# EAGLE design Xbee_shield (EAGLE 6.4)
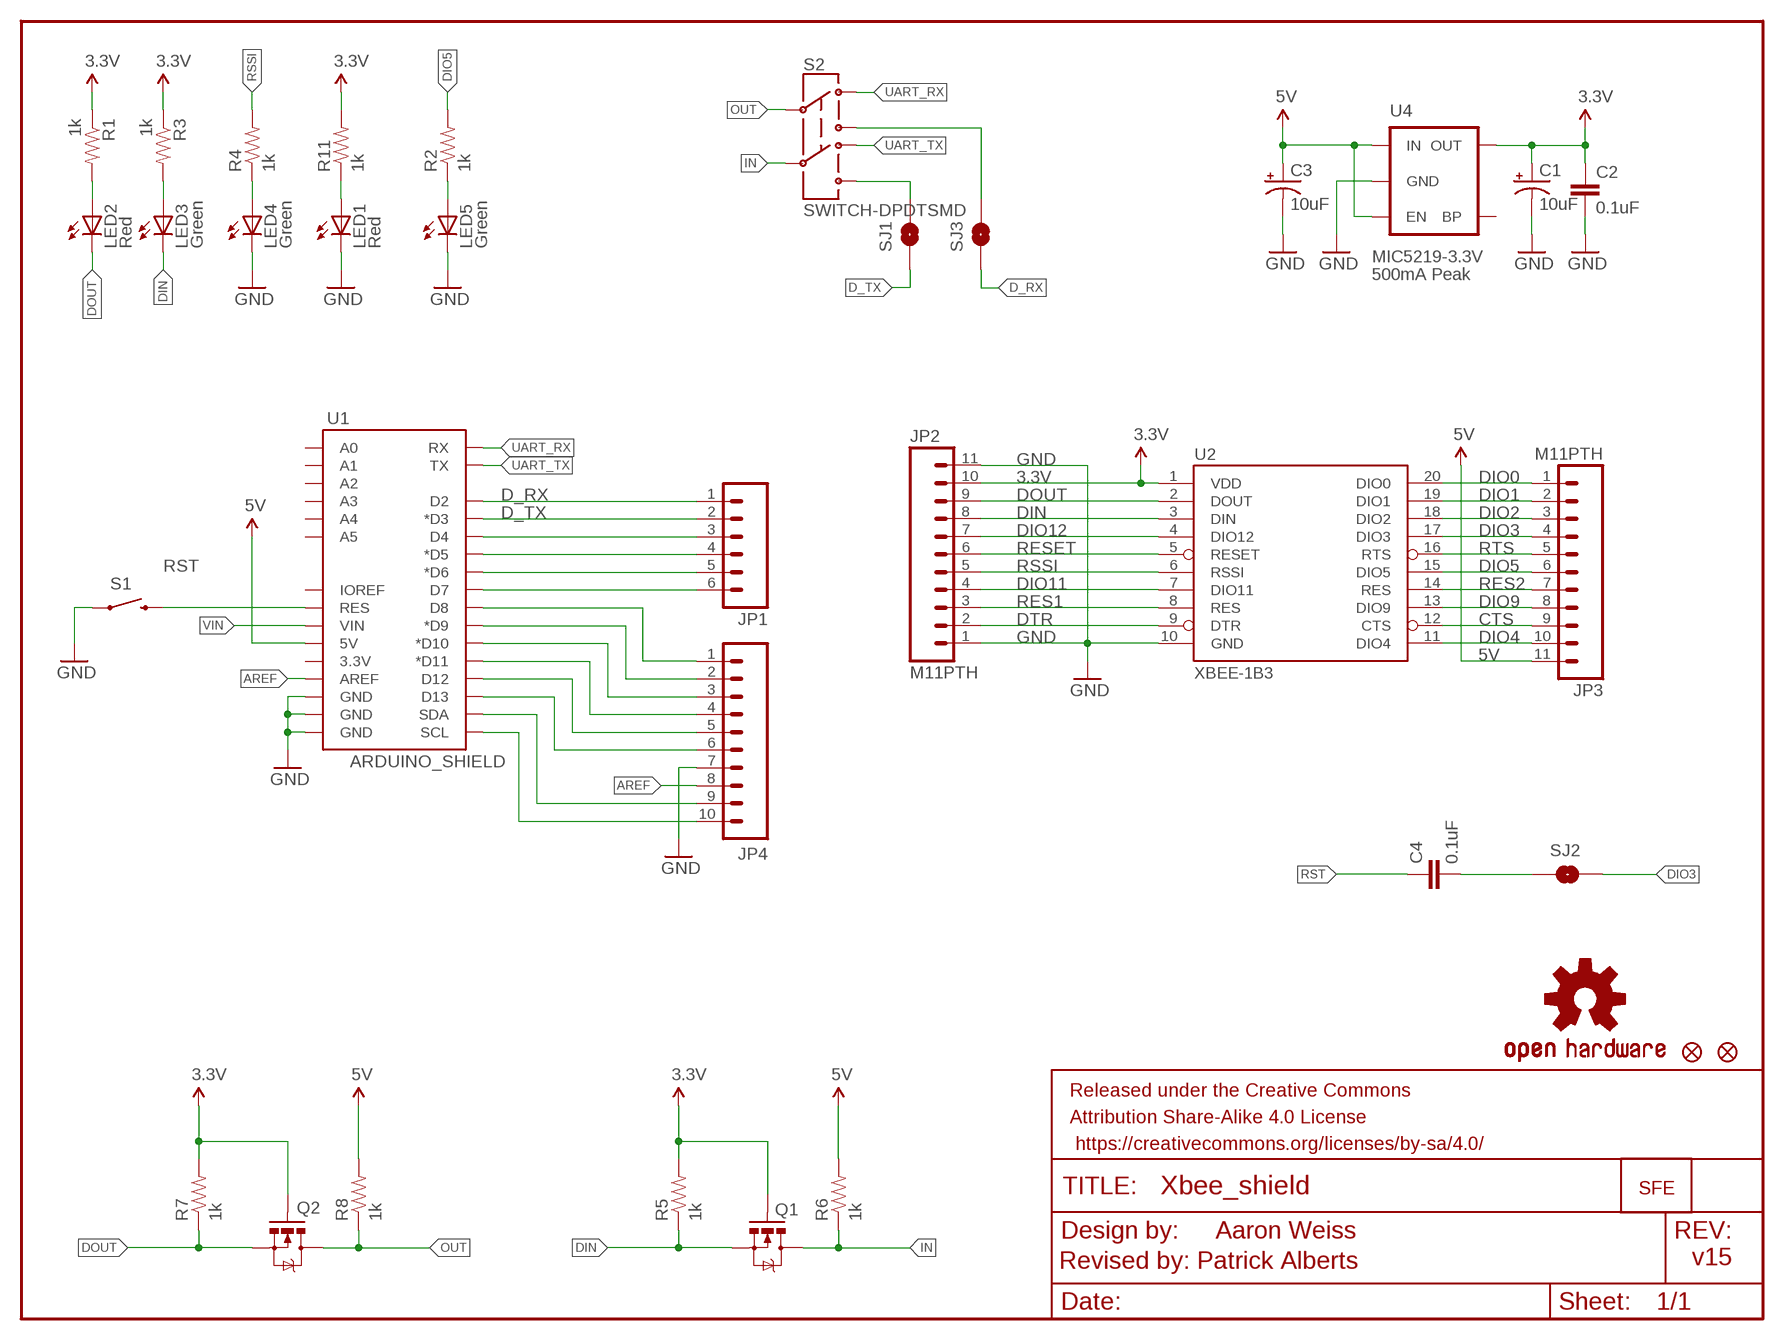
[diagram p0: schematic, sheet 1]

## Parts
C1  10uF  CAP_POL1206  [EIA3216]
C2  0.1uF  0.1UF-25V(+80/-20%)(0603)  [0603-CAP]
C3  10uF  CAP_POL1206  [EIA3216]
C4  0.1uF  0.1UF-25V(+80/-20%)(0603)  [0603-CAP]
FRAME1  FRAME-LETTER  [CREATIVE_COMMONS]
JP1  M06SIP  [1X06]
JP2  M11PTH  [1X11]
JP3  M11PTH  [1X11]
JP4  M10"  [1X10]
JP5  FIDUCIAL1X2  [FIDUCIAL-1X2]
JP6  FIDUCIAL1X2  [FIDUCIAL-1X2]
JP7  LOGO-SFENEW  [SFE-NEW-WEBLOGO]
LED1  Red  LED-RED0603  [LED-0603]
LED2  Red  LED-RED0603  [LED-0603]
LED3  Green  LED-GREEN0603  [LED-0603]
LED4  Green  LED-GREEN0603  [LED-0603]
LED5  Green  LED-GREEN0603  [LED-0603]
Q1  MOSFET-NCHANNELSMD  [SOT23-3]
Q2  MOSFET-NCHANNELSMD  [SOT23-3]
R1  1k  1KOHM1/10W1%(0603)  [0603-RES]
R2  1k  1KOHM1/10W1%(0603)  [0603-RES]
R3  1k  1KOHM1/10W1%(0603)  [0603-RES]
R4  1k  1KOHM1/10W1%(0603)  [0603-RES]
R5  1k  1KOHM1/10W1%(0603)  [0603-RES]
R6  1k  1KOHM1/10W1%(0603)  [0603-RES]
R7  1k  1KOHM1/10W1%(0603)  [0603-RES]
R8  1k  1KOHM1/10W1%(0603)  [0603-RES]
R11  1k  1KOHM1/10W1%(0603)  [0603-RES]
S1  SWITCH-MOMENTARY-2SMD  [TACTILE_SWITCH_SMD]
S2  SWITCH-DPDTSMD  [AYZ0202]
SJ1  D_TX  SOLDERJUMPERNC  [SJ_2S]
SJ2  SOLDERJUMPERTRACE  [SJ_2S-TRACE]
SJ3  D_RX  SOLDERJUMPERNC  [SJ_2S]
U1  ARDUINO_SHIELD  ARDUINO_R3_SHIELD  [UNO_R3_SHIELD]
U2  XBEE-1B3  [XBEE-SMD]
U4  V_REG_LDOSMD  [SOT23-5]
U$8  OSHW-LOGOS  [OSHW-LOGO-S]

## Nets
3.3V: C1.A(+) C2.1 JP2.10 Q1.1(G) Q2.1(G) R1.1 R3.1 R5.2 R7.2 R11.2 U2.1(VDD) U4.5(OUT)
5V: C3.A(+) JP3.11 R6.2 R8.2 U1.5V U4.1(IN) U4.3(EN)
AREF: JP4.8 U1.AREF
CTS: JP3.9 U2.12(CTS)
D_RX: JP1.1 SJ3.1 U1.D2
D_TX: JP1.2 SJ1.1 U1.D3(*D3)
DIN: JP2.8 LED3.C Q1.2(S) R5.1 U2.3(DIN)
DIO0: JP3.1 U2.20(DIO0)
DIO1: JP3.2 U2.19(DIO1)
DIO2: JP3.3 U2.18(DIO2)
DIO3: JP3.4 SJ2.2 U2.17(DIO3)
DIO4: JP3.10 U2.11(DIO4)
DIO5: JP3.6 R2.2 U2.15(DIO5)
DIO9: JP3.8 U2.13(DIO9)
DIO11: JP2.4 U2.7(DIO11)
DIO12: JP2.7 U2.4(DIO12)
DOUT: JP2.9 LED2.C Q2.2(S) R7.1 U2.2(DOUT)
DTR: JP2.2 U2.9(DTR)
GND: C1.C(-) C2.2 C3.C(-) JP2.1 JP2.11 JP4.7 LED1.C LED4.C LED5.C S1.1 U1.GND@0(GND) U1.GND@1(GND) U1.GND@2(GND) U2.10(GND) U4.2(GND)
IN: Q1.3(D) R6.1 S2.5
N$1: LED2.A R1.2
N$2: LED4.A R4.1
N$3: JP4.6 U1.D13
N$4: LED3.A R3.2
N$5: C4.2 SJ2.1
N$6: JP4.9 U1.SDA
N$7: JP4.10 U1.SCL
N$17: JP4.1 U1.D8
N$18: JP4.2 U1.D9(*D9)
N$30: JP4.3 U1.D10(*D10)
N$38: LED1.A R11.1
N$43: JP4.4 U1.D11(*D11)
N$55: JP4.5 U1.D12
N$139: LED5.A R2.1
N$140: S2.6 SJ1.2
N$141: S2.3 SJ3.2
N$142: JP1.3 U1.D4
N$143: JP1.4 U1.D5(*D5)
N$144: JP1.5 U1.D6(*D6)
N$145: JP1.6 U1.D7
OUT: Q2.3(D) R8.1 S2.2
RES1: JP2.3 U2.8(RES)
RES2: JP3.7 U2.14(RES)
RESET: JP2.6 U2.5(RESET)
RSSI: JP2.5 R4.2 U2.6(RSSI)
RST: C4.1 S1.3 U1.RES
RTS: JP3.5 U2.16(RTS)
UART_RX: S2.1 U1.RX
UART_TX: S2.4 U1.TX
VIN: U1.VIN
Unconnected: U1.3.3V U1.A0 U1.A1 U1.A2 U1.A3 U1.A4 U1.A5 U1.IOREF U4.4(BP)

## Notes on the sheet
- MIC5219-3.3V
- 500mA Peak
- Aaron Weiss
- Revised by: Patrick Alberts | v15

## Library data of the parts
C1 C3 = SparkFun:CAP_POL: Capacitor Polarized These are standard SMD and PTH capacitors. Normally 10uF, 47uF, and 100uF in electrolytic and tantalum varieties. Always verify the external diameter of the through hole cap, it varies with capacity, voltage, and manufacturer. The EIA devices should be standard.
C2 C4 = SparkFun-Capacitors:0.1UF-25V(+80/-20%)(0603): CAP-00810 Ceramic Standard decoupling cap; PROD_ID: CAP-00810
FRAME1 = SparkFun-Aesthetics:FRAME-LETTER: Schematic Frame Standard 8.5x11 US Letter frame
JP1 = SparkFun:M06: Header 6 Standard 6-pin 0.1" header. Use with straight break away headers (SKU : PRT-00116), right angle break away headers (PRT-00553), swiss pins (PRT-00743), machine pins (PRT-00117), and female headers (PRT-00115). Molex polarized connector foot print use with SKU : PRT-08094 with associated crimp pins and housings. NOTES ON THE VARIANTS LOCK and LOCK_LONGPADS... This footprint was designed to help hold the alignment of a through-hole component (i.e. 6-pin header) while soldering it into place. You may notice that each hole has been shifted either up or down by 0.005 of an inch from it's more standard position (which is a perfectly straight line). This slight alteration caused the pins (the squares in the middle) to touch the edges of the holes. Because they are alternating, it causes a "brace" to hold the component in place. 0.005 has proven to be the perfect amount of "off-center" position when using our standard breakaway headers. Although looks a little odd when you look at the bare footprint, once you have a header in there, the alteration is very hard to notice. Also, if you push a header all the way into place, it is covered up entirely on the bottom side. This idea of altering the position of holes to aid alignment will be further integrated into the Sparkfun Library for other footprints. It can help hold any component with 3 or more connection pins.
JP2 JP3 = SparkFun:M11: Header 11 Standard 11-pin 0.1" header. Use with straight break away headers (SKU : PRT-00116), right angle break away headers (PRT-00553), swiss pins (PRT-00743), machine pins (PRT-00117), and female headers (PRT-00115).
JP4 = SparkFun-Connectors:M10: Header 10 Standard 10-pin 0.1" header. Use with straight break away headers (SKU : PRT-00116), right angle break away headers (PRT-00553), swiss pins (PRT-00743), machine pins (PRT-00117), and female headers (PRT-00115).
JP5 JP6 = SparkFun:FIDUCIAL: Fiducial Alignment Points Various fiducial points for machine vision alignment.
JP7 = SparkFun-Aesthetics:LOGO-SFE: Spark Fun Electronics PCB Logo This is the standard Spark Fun Electronics PCB logo.
LED1 LED2 = SparkFun-LED:LED-RED: Assorted Red LEDs LilyPad 1206- DIO-09912 1206- DIO-00809 0603- DIO-00819; PROD_ID: DIO-00819; VALUE: RED
LED3-LED5 = SparkFun-LED:LED-GREEN: Various green LEDs Green LEDs used in SFE Production 0603- DIO-00821 LARGE- DIO-00862 LILYPAD- DIO-09910; PROD_ID: DIO-00821; VALUE: GREEN
Q1 Q2 = SparkFun-DiscreteSemi:MOSFET-NCHANNEL: Generic NMOS footprint
R1-R8 R11 = SparkFun-Resistors:1KOHM1/10W1%(0603): RES-07856; PROD_ID: RES-07856; VALUE: 1K
S1 = SparkFun:SWITCH-MOMENTARY-2
S2 = SparkFun:SWITCH-DPDT: DPDT Version of the COM-00597
SJ1-SJ3 = SparkFun:SOLDERJUMPER: Solder Jumper Standard SMD solder jumper. Used to automate production. Two varients : Normally Open and Normally Closed are the same, but have different paste layers. NC will have a large amount of paste and should jumper during reflow.
U1 = SparkFun-Boards:ARDUINO_R3_SHIELD: Shield form compatible with the Arduino Uno R3.
U2 = SparkFun:XBEE-1
U4 = SparkFun-PowerIC:V_REG_LDO: Voltage Regulator LDO Standard 150mA LDO voltage regulator in SOT-23 layout. Micrel part MIC5205. BP (by-pass) pin is used to lower output noise with 470pF cap.
U$8 = SparkFun-Aesthetics:OSHW-LOGO: Open Source Hardware Logo This logo indicates the piece of hardware it is found on incorporates a OSHW license and/or adheres to the definition of open source hardware found here: http://freedomdefined.org/OSHW

## Net classes
0 default: width 0.203 mm
1 vcc: width 0.305 mm

## Board
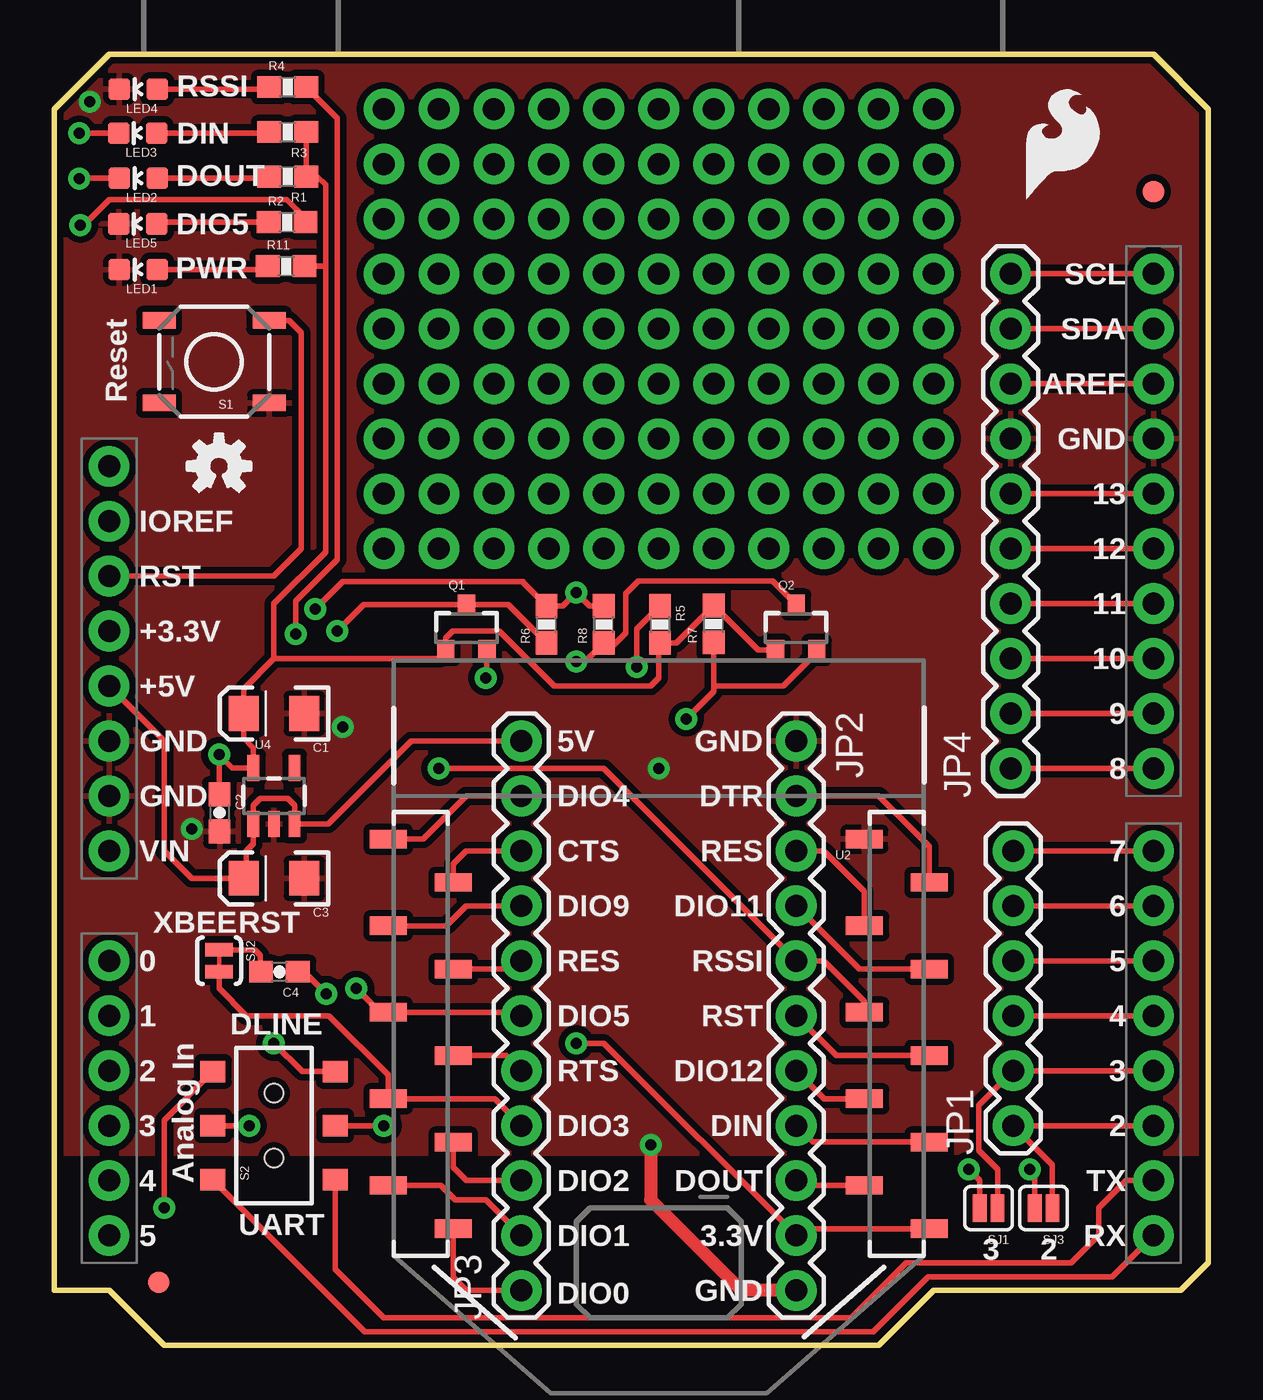
[diagram p1: board, top side]
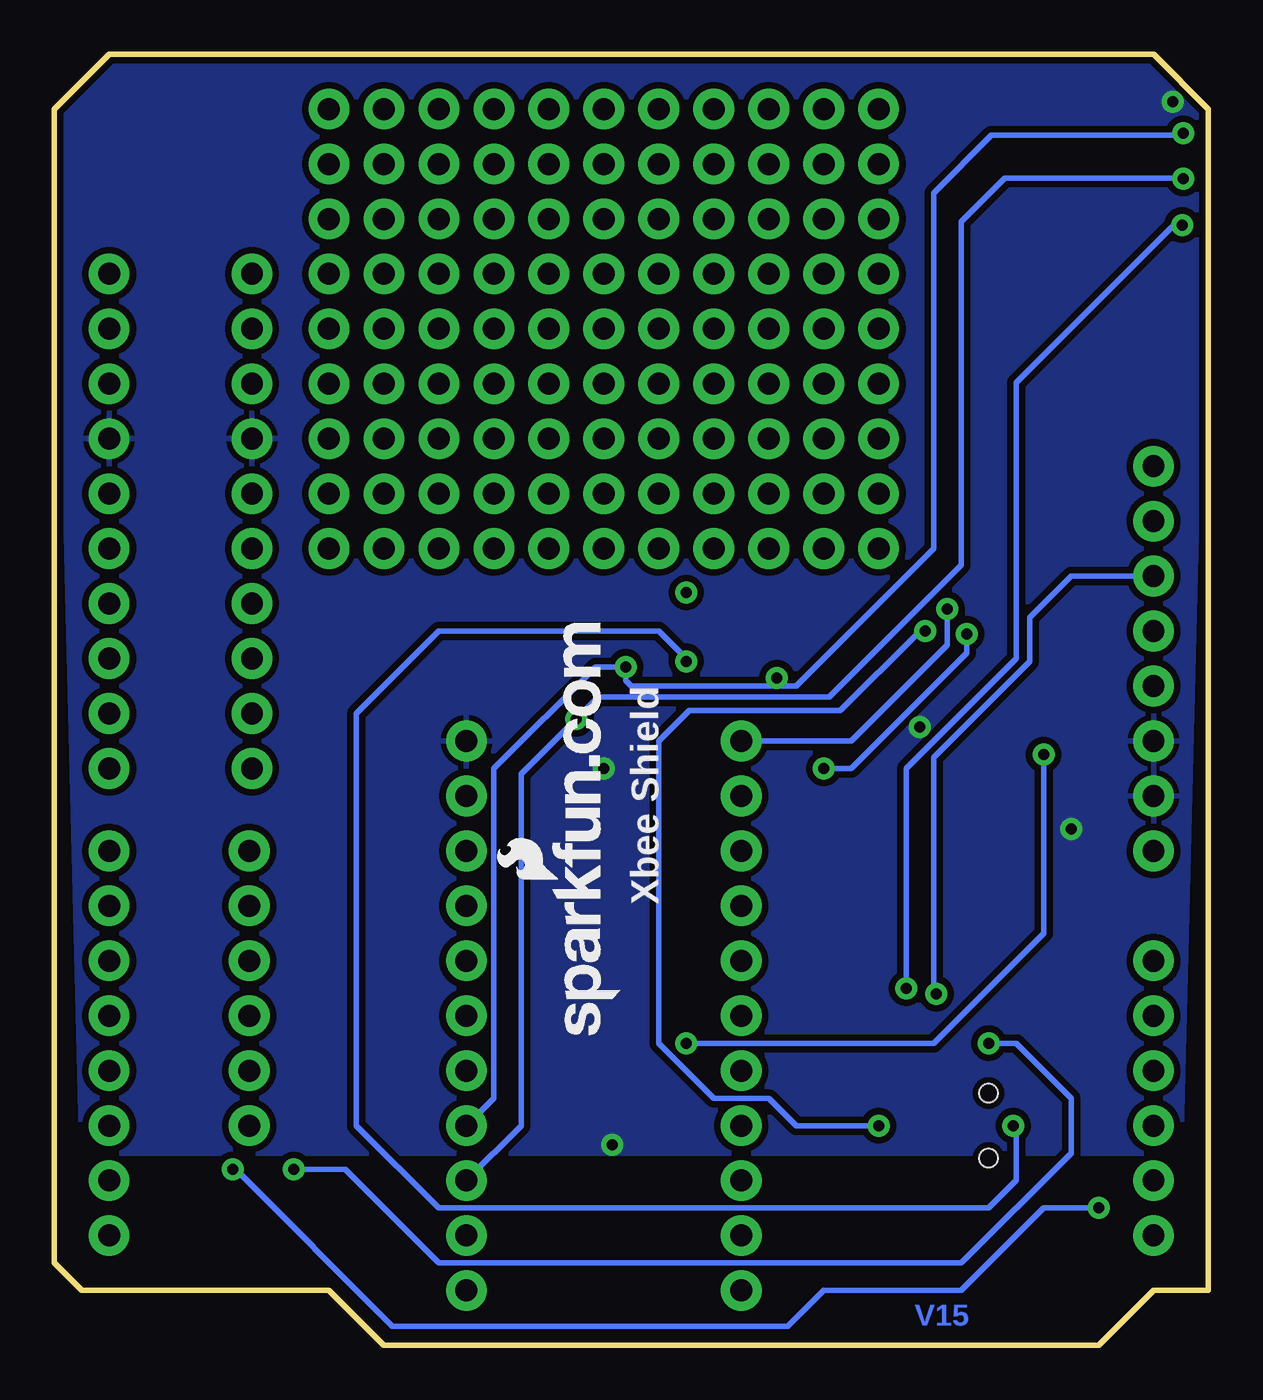
[diagram p2: board, bottom side, seen from below]

Size 53.34 x 59.69 mm. Coordinates in mm from the lower left corner, seen from the top.
Outline: 0,2.54 0,57.15 2.54,59.69 50.8,59.69 53.34,57.15 53.34,3.81 52.07,2.54 40.64,2.54 38.1,0 5.08,0 2.54,2.54 0,2.54
Copper layers (1*16): Top 0.035mm / dielectric 1.5mm / Bottom 0.035mm
Design rules "SparkFun-2-layer": minimum track width 7mil, minimum drill 15mil, track to track 8mil, track to pad 8mil, pad to pad 8mil, via to via 8mil, smd to smd 8mil, copper to edge 8mil, drill to drill 8mil, minimum pad ring 12mil, minimum via ring 10mil, stop-mask expansion 4mil, vias tented up to drill 20mil, thermal gap 10mil

### Footprints (pad centres in the part's own frame; a part is rotated, then mirrored left to right if it is on the bottom)
EIA3216 = smd 1.4 x 1.6: A 1.4,0; C -1.4,0
0603-CAP = smd 1.1 x 1: 1 -0.85,0; 2 0.85,0
1X06 = drill 1.016 pad 1.88: 1 0,0; 2 2.54,0; 3 5.08,0; 4 7.62,0; 5 10.16,0; 6 12.7,0
1X11 = drill 1.016 pad 1.88: 1 0,0; 2 2.54,0; 3 5.08,0; 4 7.62,0; 5 10.16,0; 6 12.7,0; 7 15.24,0; 8 17.78,0; 9 20.32,0; 10 22.86,0; 11 25.4,0
1X10 = drill 1.016 pad 1.88: 1 0,0; 2 2.54,0; 3 5.08,0; 4 7.62,0; 5 10.16,0; 6 12.7,0; 7 15.24,0; 8 17.78,0; 9 20.32,0; 10 22.86,0
FIDUCIAL-1X2 = smd 1 x 1: 1 0,0
LED-0603 = smd 1 x 1: A 0,-0.877; C 0,0.877
SOT23-3 = smd 0.8 x 0.9: 1 -0.95,-1; 2 0.95,-1; 3 0,1.1
0603-RES = smd 1.1 x 1: 1 -0.85,0; 2 0.85,0
TACTILE_SWITCH_SMD = smd 1.524 x 0.762: 1 -2.54,1.905; 2 2.54,1.905; 3 -2.54,-1.905; 4 2.54,-1.905
AYZ0202 = smd 1 x 1.15: 1 -2.5,2.825; 2 0,2.825; 3 2.5,2.825; 4 -2.5,-2.825; 5 0,-2.825; 6 2.5,-2.825 | hole 0.85: 1.5,0; -1.5,0
SJ_2S = smd 0.635 x 1.27: 1 -0.412,0; 2 0.412,0
SJ_2S-TRACE = smd 0.635 x 1.27: 1 -0.508,0; 2 0.508,0
UNO_R3_SHIELD = drill 1.016 pad 1.88: 3.3V 50.8,26.67; 5V 50.8,29.21; A0 50.8,41.91; A1 50.8,44.45; A2 50.8,46.99; A3 50.8,49.53; A4 50.8,52.07; A5 50.8,54.61; AREF 2.54,15.24; D2 2.54,49.53; D3 2.54,46.99; D4 2.54,44.45; D5 2.54,41.91; D6 2.54,39.37; D7 2.54,36.83; D8 2.54,33.02; D9 2.54,30.48; D10 2.54,27.94; D11 2.54,25.4; D12 2.54,22.86; D13 2.54,20.32; GND@0 50.8,31.75; GND@1 50.8,34.29; GND@2 2.54,17.78; IOREF 50.8,21.59; NC 50.8,19.05; RES 50.8,24.13; RX 2.54,54.61; SCL 2.54,10.16; SDA 2.54,12.7; TX 2.54,52.07; VIN 50.8,36.83
XBEE-SMD = smd 1.7 x 0.85: 1 -12.5,20; 2 -9.5,18; 3 -12.5,16; 4 -9.5,14; 5 -12.5,12; 6 -9.5,10; 7 -12.5,8; 8 -9.5,6; 9 -12.5,4; 10 -9.5,2; 11 12.5,2; 12 9.5,4; 13 12.5,6; 14 9.5,8; 15 12.5,10; 16 9.5,12; 17 12.5,14; 18 9.5,16; 19 12.5,18; 20 9.5,20
SOT23-5 = smd 0.55 x 1.2: 1 -0.95,-1.3; 2 0,-1.3; 3 0.95,-1.3; 4 0.95,1.3; 5 -0.95,1.3

### Placement (x,y rotation side)
C1  10.16,29.21 180 top
C2  7.65,24.61 270 top
C3  10.16,21.59 180 top
C4  10.41,17.27 180 top
FRAME1  -2.01,-16.51 0 top  (outside the outline)
JP1  44.32,10.16 90 top
JP2  34.29,27.94 270 top
JP3  21.59,2.54 90 top
JP4  44.2,26.67 90 top
JP5  4.83,2.92 0 top
JP6  50.8,53.34 0 top
JP7  27.18,14.35 90 bottom
LED1  3.89,49.73 90 top
LED2  3.89,53.95 90 top
LED3  3.86,56.03 90 top
LED4  3.89,58.06 90 top
LED5  3.86,51.84 90 top
Q1  19.05,33.15 0 top
Q2  34.29,33.15 0 top
R1  10.79,54.03 180 top
R2  10.77,51.92 0 top
R3  10.79,56.08 180 top
R4  10.79,58.17 0 top
R5  27.99,33.32 270 top
R6  22.76,33.32 90 top
R7  30.48,33.35 90 top
R8  25.4,33.32 90 top
R11  10.72,49.89 0 top
S1  7.39,45.47 180 top
S2  10.16,10.16 90 top
SJ1  43.18,6.35 180 top
SJ2  7.62,17.78 270 top
SJ3  45.72,6.35 180 top
U1  53.34,59.69 180 top
U2  27.94,25.4 180 top
U4  10.16,25.4 0 top
U$1  [SFE_LOGO_FLAME_.2]  44.58,52.7 0 top
U$8  7.62,40.64 0 top

### Tracks (layer width: path | path; a pad name or v marks a point on that pad's centre or on a via)
3.3V  (via drill 0.51)
  Top 0.254: R3.1 R1.1 12.17,54.03 12.55,53.65 12.55,49.89 | U2.1 34.61,5.4 JP2.10 25.4,13.97 v24.13,13.97 | 10.16,31.75 8.76,30.35 C1.A 8.76,28.07 9.21,27.62 U4.5 8.22,26.7 v7.62,27.3 7.62,25.49 C2.1 | 10.16,31.75 17.83,31.75 18.1,32.02 Q1.1 18.1,32.7 18.41,33.02 20.57,33.02 23.11,30.48 27.56,30.48 27.94,30.86 27.94,32.42 R5.2 28.75,32.48 R7.2 32.53,32.15 Q2.1 | 10.16,31.75 10.16,34.29 12.55,36.68 12.55,49.89 | R11.2 12.55,49.89
  Bottom 0.254: v24.13,13.97 12.7,13.97 7.62,19.05 v7.62,27.3
5V  (via drill 0.51)
  Top 0.254: U1.5V 5.08,27.94 5.08,22.86 6.35,21.59 C3.A 8.89,21.72 8.89,22.86 9.21,23.18 U4.1 9.21,24.96 9.53,25.27 10.79,25.27 11.11,24.96 U4.3 12.67,24.1 16.51,27.94 JP3.11 | v12.06,34.04 13.34,35.31 21.68,35.31 21.68,35.26 R6.2 23.51,34.17 v24.13,34.8 24.75,34.17 R8.2
  Bottom 0.254: JP3.11 16.51,27.94 12.06,32.38 v12.06,34.04
AREF
  Top 0.254: JP4.8 U1.AREF
CTS
  Top 0.254: U2.12 18.44,22.25 19.05,22.86 JP3.9
D_RX
  Top 0.254: U1.D2 JP1.1 46.13,8.35 SJ3.1
D_TX
  Top 0.254: JP1.2 U1.D3 | 44.83,12.7 JP1.2 | SJ1.1 43.59,8.15 42.72,9.02 42.72,11.1 JP1.2
DIN  (via drill 0.51)
  Top 0.254: v1.17,56.03 LED3.C | U2.3 35.05,9.4 JP2.8 | v26.92,31.37 26.92,33.11 R5.1 | v19.94,30.86 20,30.92 Q1.2
  Bottom 0.254: JP2.8 33.02,11.43 33.02,26.67 28.32,31.37 v26.92,31.37 26.92,30.73 26.67,30.48 19.94,30.48 | 19.94,30.48 19.05,30.48 12.7,36.83 12.7,53.26 10.03,55.93 1.27,55.93 v1.17,56.03 | v19.94,30.86 19.94,30.48
DIO0
  Top 0.254: U2.20 18.44,3.15 19.05,2.54 JP3.1
DIO1
  Top 0.254: JP3.2 19.94,6.73 18.54,6.73 17.87,7.4 U2.19
DIO2
  Top 0.254: U2.18 18.44,8.23 19.05,7.62 JP3.3
DIO3
  Top 0.254: JP3.4 20.35,11.4 U2.17 15.44,12.5 12.7,15.24 8.89,15.24 7.62,16.51 SJ2.2
DIO4
  Top 0.254: U2.11 17.05,23.4 19.05,25.4 JP3.10
DIO5  (via drill 0.51)
  Top 0.254: JP3.6 21.43,15.4 U2.15 15.08,15.4 v13.97,16.51 | v1.22,51.79 1.37,51.79 2.54,52.96 10.76,52.96 11.62,52.09 R2.2
  Bottom 0.254: v13.97,16.51 13.97,26.67 8.89,31.75 8.89,44.5 1.6,51.79 v1.22,51.79
DIO9
  Top 0.254: U2.13 18.13,19.4 19.05,20.32 JP3.8
DIO11
  Top 0.254: U2.7 37.21,17.4 JP2.4
DIO12
  Top 0.254: U2.4 35.59,11.4 JP2.7
DOUT  (via drill 0.51)
  Top 0.254: U2.2 34.51,7.4 JP2.9 | 30.48,30.48 30.48,30.23 v29.21,28.96 | 30.48,30.48 R7.1 | 30.48,30.48 33.7,30.48 35.24,32.02 Q2.2 | LED2.C 1.19,53.95 v1.17,53.92
  Bottom 0.254: JP2.9 31.75,10.16 31.75,26.42 v29.21,28.96 28.19,29.97 17.53,29.97 11.43,36.07 11.43,51.94 9.42,53.95 1.19,53.95 v1.17,53.92
DTR
  Top 0.254: JP2.2 38.1,25.4 40.44,23.06 U2.9
GND  (via drill 0.51)
  Top 0.61: JP2.11 31.75,2.54 27.56,6.73 v27.56,9.27
  other vias: 6.35,23.88 13.34,28.57 1.65,57.48 27.94,26.67
  pour Top (isolate 0.305): 0,8.89 0,59.69 53.34,59.69 53.34,8.89
  pour Bottom (isolate 0.305): 0,59.69 1.27,8.89 52.07,8.89 53.34,59.69
IN  (via drill 0.51)
  Top 0.254: S2.5 v15.24,10.16 | v13.08,33.02 14.31,34.25 Q1.3 20.99,34.25 R6.1
  Bottom 0.254: v15.24,10.16 19.05,10.16 20.32,11.43 22.86,11.43 25.4,13.97 25.4,27.94 24,29.34 17.02,29.34 13.46,32.89 13.21,32.89 v13.08,33.02
N$1
  Top 0.254: LED2.A 9.87,53.95 R1.2
N$2
  Top 0.254: 9.87,58.09 R4.1 9.84,58.06 LED4.A
N$3
  Top 0.254: JP4.6 U1.D13
N$4
  Top 0.254: LED3.A 9.89,56.03 R3.2
N$5
  Top 0.254: SJ2.1 9.27,18.29 9.53,18.03 9.53,17.31 C4.2
N$6
  Top 0.254: U1.SDA JP4.9
N$7
  Top 0.254: JP4.10 U1.SCL
N$17
  Top 0.254: JP4.1 U1.D8
N$18
  Top 0.254: JP4.2 U1.D9
N$30
  Top 0.254: U1.D10 JP4.3
N$31  (via drill 1.02 pad 1.88)
  other vias: 40.64,36.83
N$32  (via drill 1.02 pad 1.88)
  other vias: 38.1,36.83
N$33  (via drill 1.02 pad 1.88)
  other vias: 35.56,36.83
N$34  (via drill 1.02 pad 1.88)
  other vias: 33.02,36.83
N$35  (via drill 1.02 pad 1.88)
  other vias: 30.48,36.83
N$36  (via drill 1.02 pad 1.88)
  other vias: 27.94,36.83
N$37  (via drill 1.02 pad 1.88)
  other vias: 25.4,36.83
N$38
  Top 0.254: LED1.A 9.72,49.73 R11.1
N$39  (via drill 1.02 pad 1.88)
  other vias: 22.86,36.83
N$40  (via drill 1.02 pad 1.88)
  other vias: 20.32,36.83
N$41  (via drill 1.02 pad 1.88)
  other vias: 17.78,36.83
N$42  (via drill 1.02 pad 1.88)
  other vias: 15.24,36.83
N$43
  Top 0.254: JP4.4 U1.D11
N$44  (via drill 1.02 pad 1.88)
  other vias: 40.64,39.37
N$45  (via drill 1.02 pad 1.88)
  other vias: 38.1,39.37
N$46  (via drill 1.02 pad 1.88)
  other vias: 35.56,39.37
N$47  (via drill 1.02 pad 1.88)
  other vias: 33.02,39.37
N$48  (via drill 1.02 pad 1.88)
  other vias: 30.48,39.37
N$49  (via drill 1.02 pad 1.88)
  other vias: 27.94,39.37
N$50  (via drill 1.02 pad 1.88)
  other vias: 25.4,39.37
N$51  (via drill 1.02 pad 1.88)
  other vias: 22.86,39.37
N$52  (via drill 1.02 pad 1.88)
  other vias: 20.32,39.37
N$53  (via drill 1.02 pad 1.88)
  other vias: 17.78,39.37
N$54  (via drill 1.02 pad 1.88)
  other vias: 15.24,39.37
N$55
  Top 0.254: JP4.5 U1.D12
N$56  (via drill 1.02 pad 1.88)
  other vias: 40.64,41.91
N$57  (via drill 1.02 pad 1.88)
  other vias: 38.1,41.91
N$58  (via drill 1.02 pad 1.88)
  other vias: 35.56,41.91
N$59  (via drill 1.02 pad 1.88)
  other vias: 33.02,41.91
N$60  (via drill 1.02 pad 1.88)
  other vias: 30.48,41.91
N$61  (via drill 1.02 pad 1.88)
  other vias: 27.94,41.91
N$62  (via drill 1.02 pad 1.88)
  other vias: 25.4,41.91
N$63  (via drill 1.02 pad 1.88)
  other vias: 22.86,41.91
N$64  (via drill 1.02 pad 1.88)
  other vias: 20.32,41.91
N$65  (via drill 1.02 pad 1.88)
  other vias: 17.78,41.91
N$66  (via drill 1.02 pad 1.88)
  other vias: 15.24,41.91
N$68  (via drill 1.02 pad 1.88)
  other vias: 40.64,44.45
N$69  (via drill 1.02 pad 1.88)
  other vias: 38.1,44.45
N$70  (via drill 1.02 pad 1.88)
  other vias: 35.56,44.45
N$71  (via drill 1.02 pad 1.88)
  other vias: 33.02,44.45
N$72  (via drill 1.02 pad 1.88)
  other vias: 30.48,44.45
N$73  (via drill 1.02 pad 1.88)
  other vias: 27.94,44.45
N$74  (via drill 1.02 pad 1.88)
  other vias: 25.4,44.45
N$75  (via drill 1.02 pad 1.88)
  other vias: 22.86,44.45
N$76  (via drill 1.02 pad 1.88)
  other vias: 20.32,44.45
N$77  (via drill 1.02 pad 1.88)
  other vias: 17.78,44.45
N$78  (via drill 1.02 pad 1.88)
  other vias: 15.24,44.45
N$80  (via drill 1.02 pad 1.88)
  other vias: 40.64,46.99
N$81  (via drill 1.02 pad 1.88)
  other vias: 38.1,46.99
N$82  (via drill 1.02 pad 1.88)
  other vias: 35.56,46.99
N$83  (via drill 1.02 pad 1.88)
  other vias: 33.02,46.99
N$84  (via drill 1.02 pad 1.88)
  other vias: 30.48,46.99
N$85  (via drill 1.02 pad 1.88)
  other vias: 27.94,46.99
N$86  (via drill 1.02 pad 1.88)
  other vias: 25.4,46.99
N$87  (via drill 1.02 pad 1.88)
  other vias: 22.86,46.99
N$88  (via drill 1.02 pad 1.88)
  other vias: 20.32,46.99
N$89  (via drill 1.02 pad 1.88)
  other vias: 17.78,46.99
N$90  (via drill 1.02 pad 1.88)
  other vias: 15.24,46.99
N$92  (via drill 1.02 pad 1.88)
  other vias: 40.64,49.53
N$93  (via drill 1.02 pad 1.88)
  other vias: 38.1,49.53
N$94  (via drill 1.02 pad 1.88)
  other vias: 35.56,49.53
N$95  (via drill 1.02 pad 1.88)
  other vias: 33.02,49.53
N$96  (via drill 1.02 pad 1.88)
  other vias: 30.48,49.53
N$97  (via drill 1.02 pad 1.88)
  other vias: 27.94,49.53
N$98  (via drill 1.02 pad 1.88)
  other vias: 25.4,49.53
N$99  (via drill 1.02 pad 1.88)
  other vias: 22.86,49.53
N$100  (via drill 1.02 pad 1.88)
  other vias: 20.32,49.53
N$101  (via drill 1.02 pad 1.88)
  other vias: 17.78,49.53
N$102  (via drill 1.02 pad 1.88)
  other vias: 15.24,49.53
N$104  (via drill 1.02 pad 1.88)
  other vias: 40.64,52.07
N$105  (via drill 1.02 pad 1.88)
  other vias: 38.1,52.07
N$106  (via drill 1.02 pad 1.88)
  other vias: 35.56,52.07
N$107  (via drill 1.02 pad 1.88)
  other vias: 33.02,52.07
N$108  (via drill 1.02 pad 1.88)
  other vias: 30.48,52.07
N$109  (via drill 1.02 pad 1.88)
  other vias: 27.94,52.07
N$110  (via drill 1.02 pad 1.88)
  other vias: 25.4,52.07
N$111  (via drill 1.02 pad 1.88)
  other vias: 22.86,52.07
N$112  (via drill 1.02 pad 1.88)
  other vias: 20.32,52.07
N$113  (via drill 1.02 pad 1.88)
  other vias: 17.78,52.07
N$114  (via drill 1.02 pad 1.88)
  other vias: 15.24,52.07
N$116  (via drill 1.02 pad 1.88)
  other vias: 40.64,54.61
N$117  (via drill 1.02 pad 1.88)
  other vias: 38.1,54.61
N$118  (via drill 1.02 pad 1.88)
  other vias: 35.56,54.61
N$119  (via drill 1.02 pad 1.88)
  other vias: 33.02,54.61
N$120  (via drill 1.02 pad 1.88)
  other vias: 30.48,54.61
N$121  (via drill 1.02 pad 1.88)
  other vias: 27.94,54.61
N$122  (via drill 1.02 pad 1.88)
  other vias: 25.4,54.61
N$123  (via drill 1.02 pad 1.88)
  other vias: 22.86,54.61
N$124  (via drill 1.02 pad 1.88)
  other vias: 20.32,54.61
N$125  (via drill 1.02 pad 1.88)
  other vias: 17.78,54.61
N$126  (via drill 1.02 pad 1.88)
  other vias: 15.24,54.61
N$128  (via drill 1.02 pad 1.88)
  other vias: 40.64,57.15
N$129  (via drill 1.02 pad 1.88)
  other vias: 38.1,57.15
N$130  (via drill 1.02 pad 1.88)
  other vias: 35.56,57.15
N$131  (via drill 1.02 pad 1.88)
  other vias: 33.02,57.15
N$132  (via drill 1.02 pad 1.88)
  other vias: 30.48,57.15
N$133  (via drill 1.02 pad 1.88)
  other vias: 27.94,57.15
N$134  (via drill 1.02 pad 1.88)
  other vias: 25.4,57.15
N$135  (via drill 1.02 pad 1.88)
  other vias: 22.86,57.15
N$136  (via drill 1.02 pad 1.88)
  other vias: 20.32,57.15
N$137  (via drill 1.02 pad 1.88)
  other vias: 17.78,57.15
N$138  (via drill 1.02 pad 1.88)
  other vias: 15.24,57.15
N$139
  Top 0.254: LED5.A 4.81,51.92 R2.1
N$140  (via drill 0.51)
  Top 0.254: S2.6 11.47,12.66 v10.16,13.97 | SJ1.2 42.77,7.62 v42.27,8.13
  Bottom 0.254: v42.27,8.13 39.88,8.13 35.56,3.81 11.43,3.81 6.35,8.89 6.35,11.43 8.89,13.97 v10.16,13.97
N$141  (via drill 0.51)
  Top 0.254: v45.09,8.13 45.31,7.91 SJ3.2 | v5.08,6.35 5.08,10.4 S2.3
  Bottom 0.254: v45.09,8.13 44.96,8.13 37.72,0.89 19.43,0.89 17.78,2.54 11.43,2.54 7.62,6.35 v5.08,6.35
N$142
  Top 0.254: JP1.3 U1.D4
N$143
  Top 0.254: JP1.4 U1.D5
N$144
  Top 0.254: JP1.5 U1.D6
N$145
  Top 0.254: JP1.6 U1.D7
OUT  (via drill 0.51)
  Top 0.254: S2.2 v9.02,10.16 | v24.13,31.62 24.55,31.62 R8.1 arc90 25.53,32.37 25.87,32.37 26.42,32.92 26.42,34.75 27,35.33 33.21,35.33 Q2.3
  Bottom 0.254: v24.13,31.62 24.13,31.75 25.4,33.02 35.56,33.02 39.37,29.21 39.37,10.16 35.56,6.35 10.16,6.35 8.89,7.62 8.89,10.03 v9.02,10.16
RES1
  Top 0.254: JP2.3 35.56,22.86 37.44,20.98 U2.8
RES2
  Top 0.254: U2.14 21.21,17.4 JP3.7
RESET
  Top 0.254: U2.5 36.13,13.4 JP2.6
RSSI  (via drill 0.51)
  Top 0.254: U2.6 37.44,15.9 35.56,17.78 JP2.5 25.4,26.67 v17.78,26.67 | v11.18,32.89 11.18,34.42 13.08,36.32 13.08,56.73 R4.2
  Bottom 0.254: v17.78,26.67 16.51,26.67 11.18,32 v11.18,32.89
RST  (via drill 0.51)
  Top 0.254: U1.RES 10.16,35.56 11.43,36.83 11.43,46.81 10.87,47.37 S1.3 | C4.1 11.56,17.27 v12.57,16.26
  Bottom 0.254: 4.32,35.56 U1.RES 6.35,35.56 8.26,33.66 8.26,31.62 12.7,27.18 12.7,16.38 v12.57,16.26
RTS
  Top 0.254: U2.16 20.89,13.4 JP3.5
UART_RX
  Top 0.254: U1.RX 48.9,3.17 40.39,3.17 37.85,0.64 14.36,0.64 S2.1
UART_TX
  Top 0.254: S2.4 12.98,3.52 15.24,1.27 36.83,1.27 39.37,3.81 46.99,3.81 48.26,5.08 48.26,6.35 49.53,7.62 U1.TX

### Text on the board
Bottom: V15
tPlace: RSSI | DIN | DOUT | DIO5 | PWR | Reset | GND | 5V | DTR | DIO4 | RES | CTS | DIO11 | DIO9 | XBEE | RST | RSSI | RES | RST | DIO5 | DLINE | DIO12 | RTS | DIN | DIO3 | DOUT | DIO2 | 3.3V | UART | DIO1 | 3 | 2 | GND | DIO0
bPlace: Xbee Shield
tDocu: A. Weiss | Revised by: Patrick Alberts